# EAGLE schematic 6502-shield (EAGLE 9.6.0)

## Sheet 1 of 3
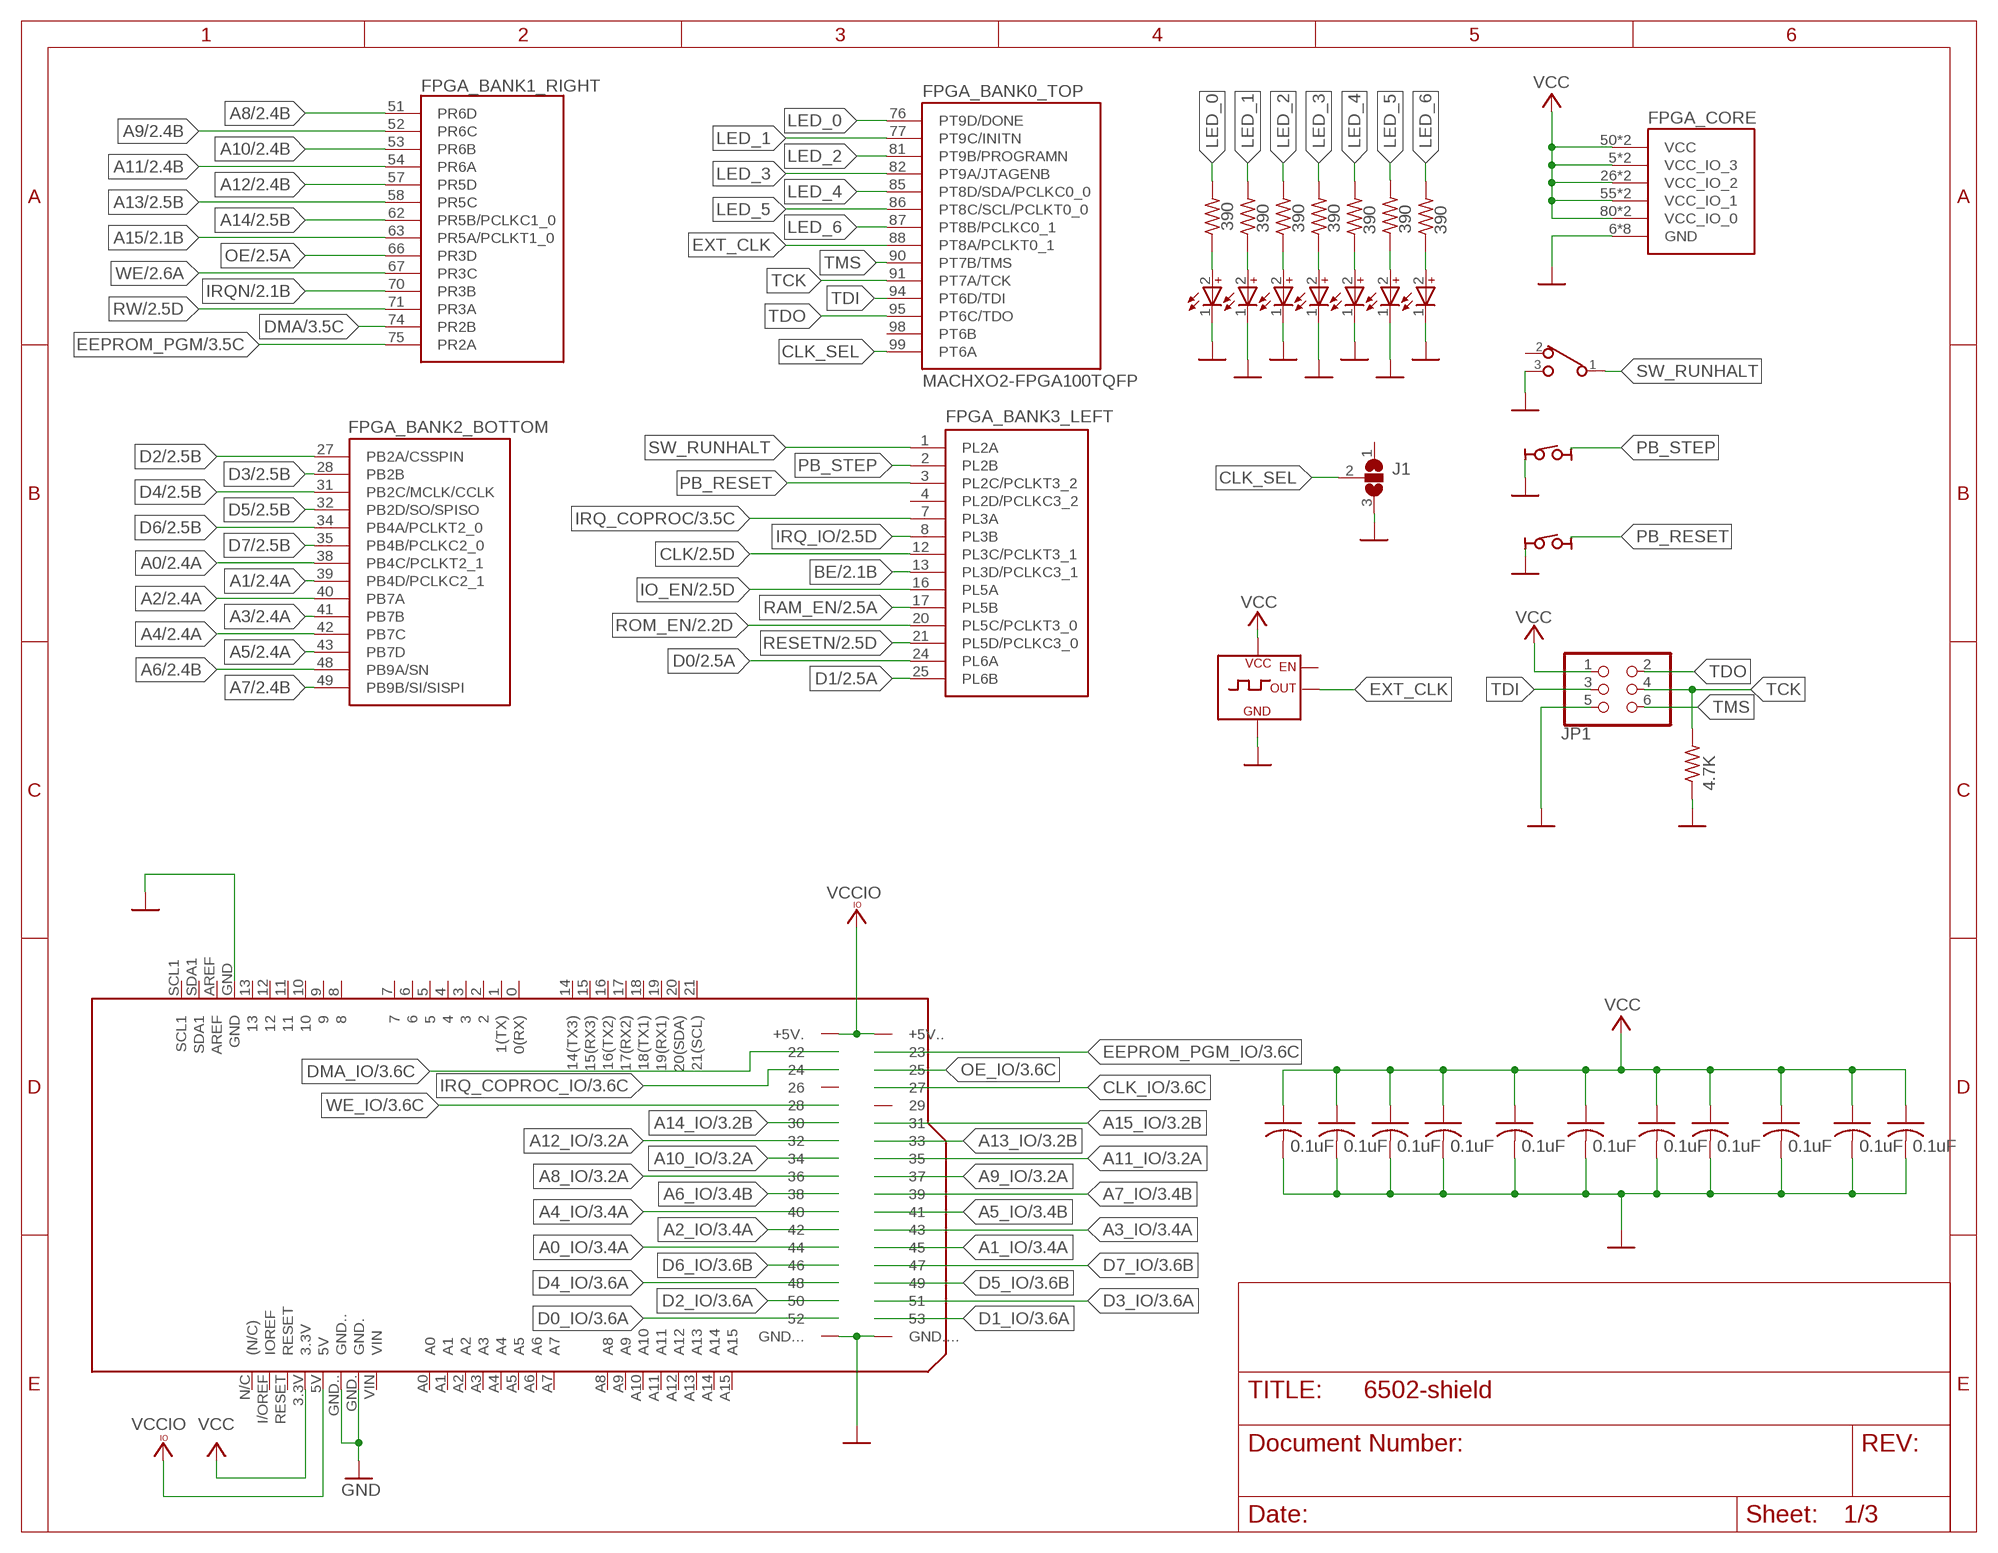
[diagram p0: schematic, sheet 1]

### Parts
C1  0.1uF  C-USC0805  [C0805]
C2  0.1uF  C-USC0805  [C0805]
C3  0.1uF  C-USC0805  [C0805]
C4  0.1uF  C-USC0805  [C0805]
C5  0.1uF  C-USC0805  [C0805]
C6  0.1uF  C-USC0805  [C0805]
C7  0.1uF  C-USC0805  [C0805]
C20  0.1uF  C-USC0805  [C0805]
C21  0.1uF  C-USC0805  [C0805]
C22  0.1uF  C-USC0805  [C0805]
C23  0.1uF  C-USC0805  [C0805]
D1  RED  WL-SMCD_0603_150060SS55040  [WL-SMCD_0603]
D2  RED  WL-SMCD_0603_150060SS55040  [WL-SMCD_0603]
D3  RED  WL-SMCD_0603_150060SS55040  [WL-SMCD_0603]
D4  RED  WL-SMCD_0603_150060SS55040  [WL-SMCD_0603]
D5  RED  WL-SMCD_0603_150060SS55040  [WL-SMCD_0603]
D6  RED  WL-SMCD_0603_150060SS55040  [WL-SMCD_0603]
D7  RED  WL-SMCD_0603_150060SS55040  [WL-SMCD_0603]
EXT_XO  CRYSTAL-OSC-DIP8/4  [DIP8/4]
FPGA  MACHXO2-FPGA100TQFP  [QFP50P1600X1600X160-100N]
J1  SJ2W  [SJ_2]
JP1  PINHD-2X3  [2X03]
PB_RESET  MCSLPT4644B1TR-TACT-SW  [MCSLPT4644B1TR-TACT-SW-NEW]
PB_STEP  MCSLPT4644B1TR-TACT-SW  [MCSLPT4644B1TR-TACT-SW-NEW]
PCB1  ARDUINO_MEGA2560  [ARDUINO_MEGA2560]
R2  390  R-US_R0603  [R0603]
R3  4.7K  R-US_R0603  [R0603]
R4  390  R-US_R0603  [R0603]
R5  390  R-US_R0603  [R0603]
R6  390  R-US_R0603  [R0603]
R7  390  R-US_R0603  [R0603]
R8  390  R-US_R0603  [R0603]
R9  390  R-US_R0603  [R0603]
SW_RUNHALT  PCM12SMTR-SPDT-RIGHT-ANG  [PCM12SMTR]

### Nets
A0: FPGA.38(_BANK2_BOTTOM:PB4C/PCLKT2_1) ; also sheet 2,3
A0_IO: PCB1.44 ; also sheet 3
A1: FPGA.39(_BANK2_BOTTOM:PB4D/PCLKC2_1) ; also sheet 2,3
A1_IO: PCB1.45 ; also sheet 3
A2: FPGA.40(_BANK2_BOTTOM:PB7A) ; also sheet 2,3
A2_IO: PCB1.42 ; also sheet 3
A3: FPGA.41(_BANK2_BOTTOM:PB7B) ; also sheet 2,3
A3_IO: PCB1.43 ; also sheet 3
A4: FPGA.42(_BANK2_BOTTOM:PB7C) ; also sheet 2,3
A4_IO: PCB1.40 ; also sheet 3
A5: FPGA.43(_BANK2_BOTTOM:PB7D) ; also sheet 2,3
A5_IO: PCB1.41 ; also sheet 3
A6: FPGA.48(_BANK2_BOTTOM:PB9A/SN) ; also sheet 2,3
A6_IO: PCB1.38 ; also sheet 3
A7: FPGA.49(_BANK2_BOTTOM:PB9B/SI/SISPI) ; also sheet 2,3
A7_IO: PCB1.39 ; also sheet 3
A8: FPGA.51(_BANK1_RIGHT:PR6D) ; also sheet 2,3
A8_IO: PCB1.36 ; also sheet 3
A9: FPGA.52(_BANK1_RIGHT:PR6C) ; also sheet 2,3
A9_IO: PCB1.37 ; also sheet 3
A10: FPGA.53(_BANK1_RIGHT:PR6B) ; also sheet 2,3
A10_IO: PCB1.34 ; also sheet 3
A11: FPGA.54(_BANK1_RIGHT:PR6A) ; also sheet 2,3
A11_IO: PCB1.35 ; also sheet 3
A12: FPGA.57(_BANK1_RIGHT:PR5D) ; also sheet 2,3
A12_IO: PCB1.32 ; also sheet 3
A13: FPGA.58(_BANK1_RIGHT:PR5C) ; also sheet 2,3
A13_IO: PCB1.33 ; also sheet 3
A14: FPGA.62(_BANK1_RIGHT:PR5B/PCLKC1_0) ; also sheet 2,3
A14_IO: PCB1.30 ; also sheet 3
A15: FPGA.63(_BANK1_RIGHT:PR5A/PCLKT1_0) ; also sheet 2,3
A15_IO: PCB1.31 ; also sheet 3
BE: FPGA.13(_BANK3_LEFT:PL3D/PCLKC3_1) ; also sheet 2
CLK: FPGA.12(_BANK3_LEFT:PL3C/PCLKT3_1) ; also sheet 2,3
CLK_IO: PCB1.27 ; also sheet 3
CLK_SEL: FPGA.99(_BANK0_TOP:PT6A) J1.2
D0: FPGA.24(_BANK3_LEFT:PL6A) ; also sheet 2,3
D0_IO: PCB1.52 ; also sheet 3
D1: FPGA.25(_BANK3_LEFT:PL6B) ; also sheet 2,3
D1_IO: PCB1.53 ; also sheet 3
D2: FPGA.27(_BANK2_BOTTOM:PB2A/CSSPIN) ; also sheet 2,3
D2_IO: PCB1.50 ; also sheet 3
D3: FPGA.28(_BANK2_BOTTOM:PB2B) ; also sheet 2,3
D3_IO: PCB1.51 ; also sheet 3
D4: FPGA.31(_BANK2_BOTTOM:PB2C/MCLK/CCLK) ; also sheet 2,3
D4_IO: PCB1.48 ; also sheet 3
D5: FPGA.32(_BANK2_BOTTOM:PB2D/SO/SPISO) ; also sheet 2,3
D5_IO: PCB1.49 ; also sheet 3
D6: FPGA.34(_BANK2_BOTTOM:PB4A/PCLKT2_0) ; also sheet 2,3
D6_IO: PCB1.46 ; also sheet 3
D7: FPGA.35(_BANK2_BOTTOM:PB4B/PCLKC2_0) ; also sheet 2,3
D7_IO: PCB1.47 ; also sheet 3
DMA: FPGA.74(_BANK1_RIGHT:PR2B) ; also sheet 3
DMA_IO: PCB1.22 ; also sheet 3
EEPROM_PGM: FPGA.75(_BANK1_RIGHT:PR2A) ; also sheet 3
EEPROM_PGM_IO: PCB1.23 ; also sheet 3
EXT_CLK: EXT_XO.5(OUT) FPGA.88(_BANK0_TOP:PT8A/PCLKT0_1)
GND: C1.2 C2.2 C3.2 C4.2 C5.2 C6.2 C7.2 C20.2 C21.2 C22.2 C23.2 D1.1(C) D2.1(C) D3.1(C) D4.1(C) D5.1(C) D6.1(C) D7.1(C) EXT_XO.4(GND) FPGA.6(_CORE:GND) FPGA.22(_CORE:GND) FPGA.33(_CORE:GND) FPGA.44(_CORE:GND) FPGA.56(_CORE:GND) FPGA.72(_CORE:GND) FPGA.79(_CORE:GND) FPGA.92(_CORE:GND) J1.3 JP1.5 PB_RESET.T2 PB_STEP.T2 PCB1.GND PCB1.GND. PCB1.GND.. PCB1.GND... PCB1.GND.... R3.1 SW_RUNHALT.3 ; also sheet 2,3
IO_EN: FPGA.16(_BANK3_LEFT:PL5A) ; also sheet 2
IRQ_COPROC: FPGA.7(_BANK3_LEFT:PL3A) ; also sheet 3
IRQ_COPROC_IO: PCB1.24 ; also sheet 3
IRQ_IO: FPGA.8(_BANK3_LEFT:PL3B) ; also sheet 2
IRQN: FPGA.70(_BANK1_RIGHT:PR3B) ; also sheet 2
LED_0: FPGA.76(_BANK0_TOP:PT9D/DONE) R5.2
LED_1: FPGA.77(_BANK0_TOP:PT9C/INITN) R6.2
LED_2: FPGA.81(_BANK0_TOP:PT9B/PROGRAMN) R7.2
LED_3: FPGA.82(_BANK0_TOP:PT9A/JTAGENB) R8.2
LED_4: FPGA.85(_BANK0_TOP:PT8D/SDA/PCLKC0_0) R9.2
LED_5: FPGA.86(_BANK0_TOP:PT8C/SCL/PCLKT0_0) R4.2
LED_6: FPGA.87(_BANK0_TOP:PT8B/PCLKC0_1) R2.2
N$9: D1.2(A) R5.1
N$10: D2.2(A) R6.1
N$11: D5.2(A) R7.1
N$12: D4.2(A) R8.1
N$13: D3.2(A) R9.1
N$14: D6.2(A) R4.1
N$15: D7.2(A) R2.1
OE: FPGA.66(_BANK1_RIGHT:PR3D) ; also sheet 2,3
OE_IO: PCB1.25 ; also sheet 3
PB_RESET: FPGA.3(_BANK3_LEFT:PL2C/PCLKT3_2) PB_RESET.T3
PB_STEP: FPGA.2(_BANK3_LEFT:PL2B) PB_STEP.T3
RAM_EN: FPGA.17(_BANK3_LEFT:PL5B) ; also sheet 2
RESETN: FPGA.21(_BANK3_LEFT:PL5D/PCLKC3_0) ; also sheet 2
ROM_EN: FPGA.20(_BANK3_LEFT:PL5C/PCLKT3_0) ; also sheet 2
RW: FPGA.71(_BANK1_RIGHT:PR3A) ; also sheet 2
SW_RUNHALT: FPGA.1(_BANK3_LEFT:PL2A) SW_RUNHALT.1
TCK: FPGA.91(_BANK0_TOP:PT7A/TCK) JP1.4 R3.2
TDI: FPGA.94(_BANK0_TOP:PT6D/TDI) JP1.3
TDO: FPGA.95(_BANK0_TOP:PT6C/TDO) JP1.2
TMS: FPGA.90(_BANK0_TOP:PT7B/TMS) JP1.6
VCC [power]: C1.1 C2.1 C3.1 C4.1 C5.1 C6.1 C7.1 C20.1 C21.1 C22.1 C23.1 EXT_XO.8(VCC) FPGA.5(_CORE:VCC_IO_3) FPGA.23(_CORE:VCC_IO_3) FPGA.26(_CORE:VCC_IO_2) FPGA.46(_CORE:VCC_IO_2) FPGA.50(_CORE:VCC) FPGA.55(_CORE:VCC_IO_1) FPGA.73(_CORE:VCC_IO_1) FPGA.80(_CORE:VCC_IO_0) FPGA.93(_CORE:VCC_IO_0) FPGA.100(_CORE:VCC) JP1.1 PCB1.3.3V ; also sheet 2,3
VCCIO [power]: PCB1.5V PCB1.5V.(+5V.) PCB1.5V..(+5V..) ; also sheet 2,3
WE: FPGA.67(_BANK1_RIGHT:PR3C) ; also sheet 2,3
WE_IO: PCB1.28 ; also sheet 3
Unconnected: EXT_XO.1(EN) FPGA.4(_BANK3_LEFT:PL2D/PCLKC3_2) FPGA.98(_BANK0_TOP:PT6B) J1.1 PB_RESET.T1 PB_RESET.T4 PB_STEP.T1 PB_STEP.T4 PCB1.0(0(RX)) PCB1.1(1(TX)) PCB1.2 PCB1.3 PCB1.4 PCB1.5 PCB1.6 PCB1.7 PCB1.8 PCB1.9 PCB1.10 PCB1.11 PCB1.12 PCB1.13 PCB1.14(14(TX3)) PCB1.15(15(RX3)) PCB1.16(16(TX2)) PCB1.17(17(RX2)) PCB1.18(18(TX1)) PCB1.19(19(RX1)) PCB1.20(20(SDA)) PCB1.21(21(SCL)) PCB1.26 PCB1.29 PCB1.A0 PCB1.A1 PCB1.A2 PCB1.A3 PCB1.A4 PCB1.A5 PCB1.A6 PCB1.A7 PCB1.A8 PCB1.A9 PCB1.A10 PCB1.A11 PCB1.A12 PCB1.A13 PCB1.A14 PCB1.A15 PCB1.AREF PCB1.I/OREF(IOREF) PCB1.N/C((N/C)) PCB1.RESET PCB1.SCL1 PCB1.SDA1 PCB1.VIN SW_RUNHALT.2

## Sheet 2 of 3
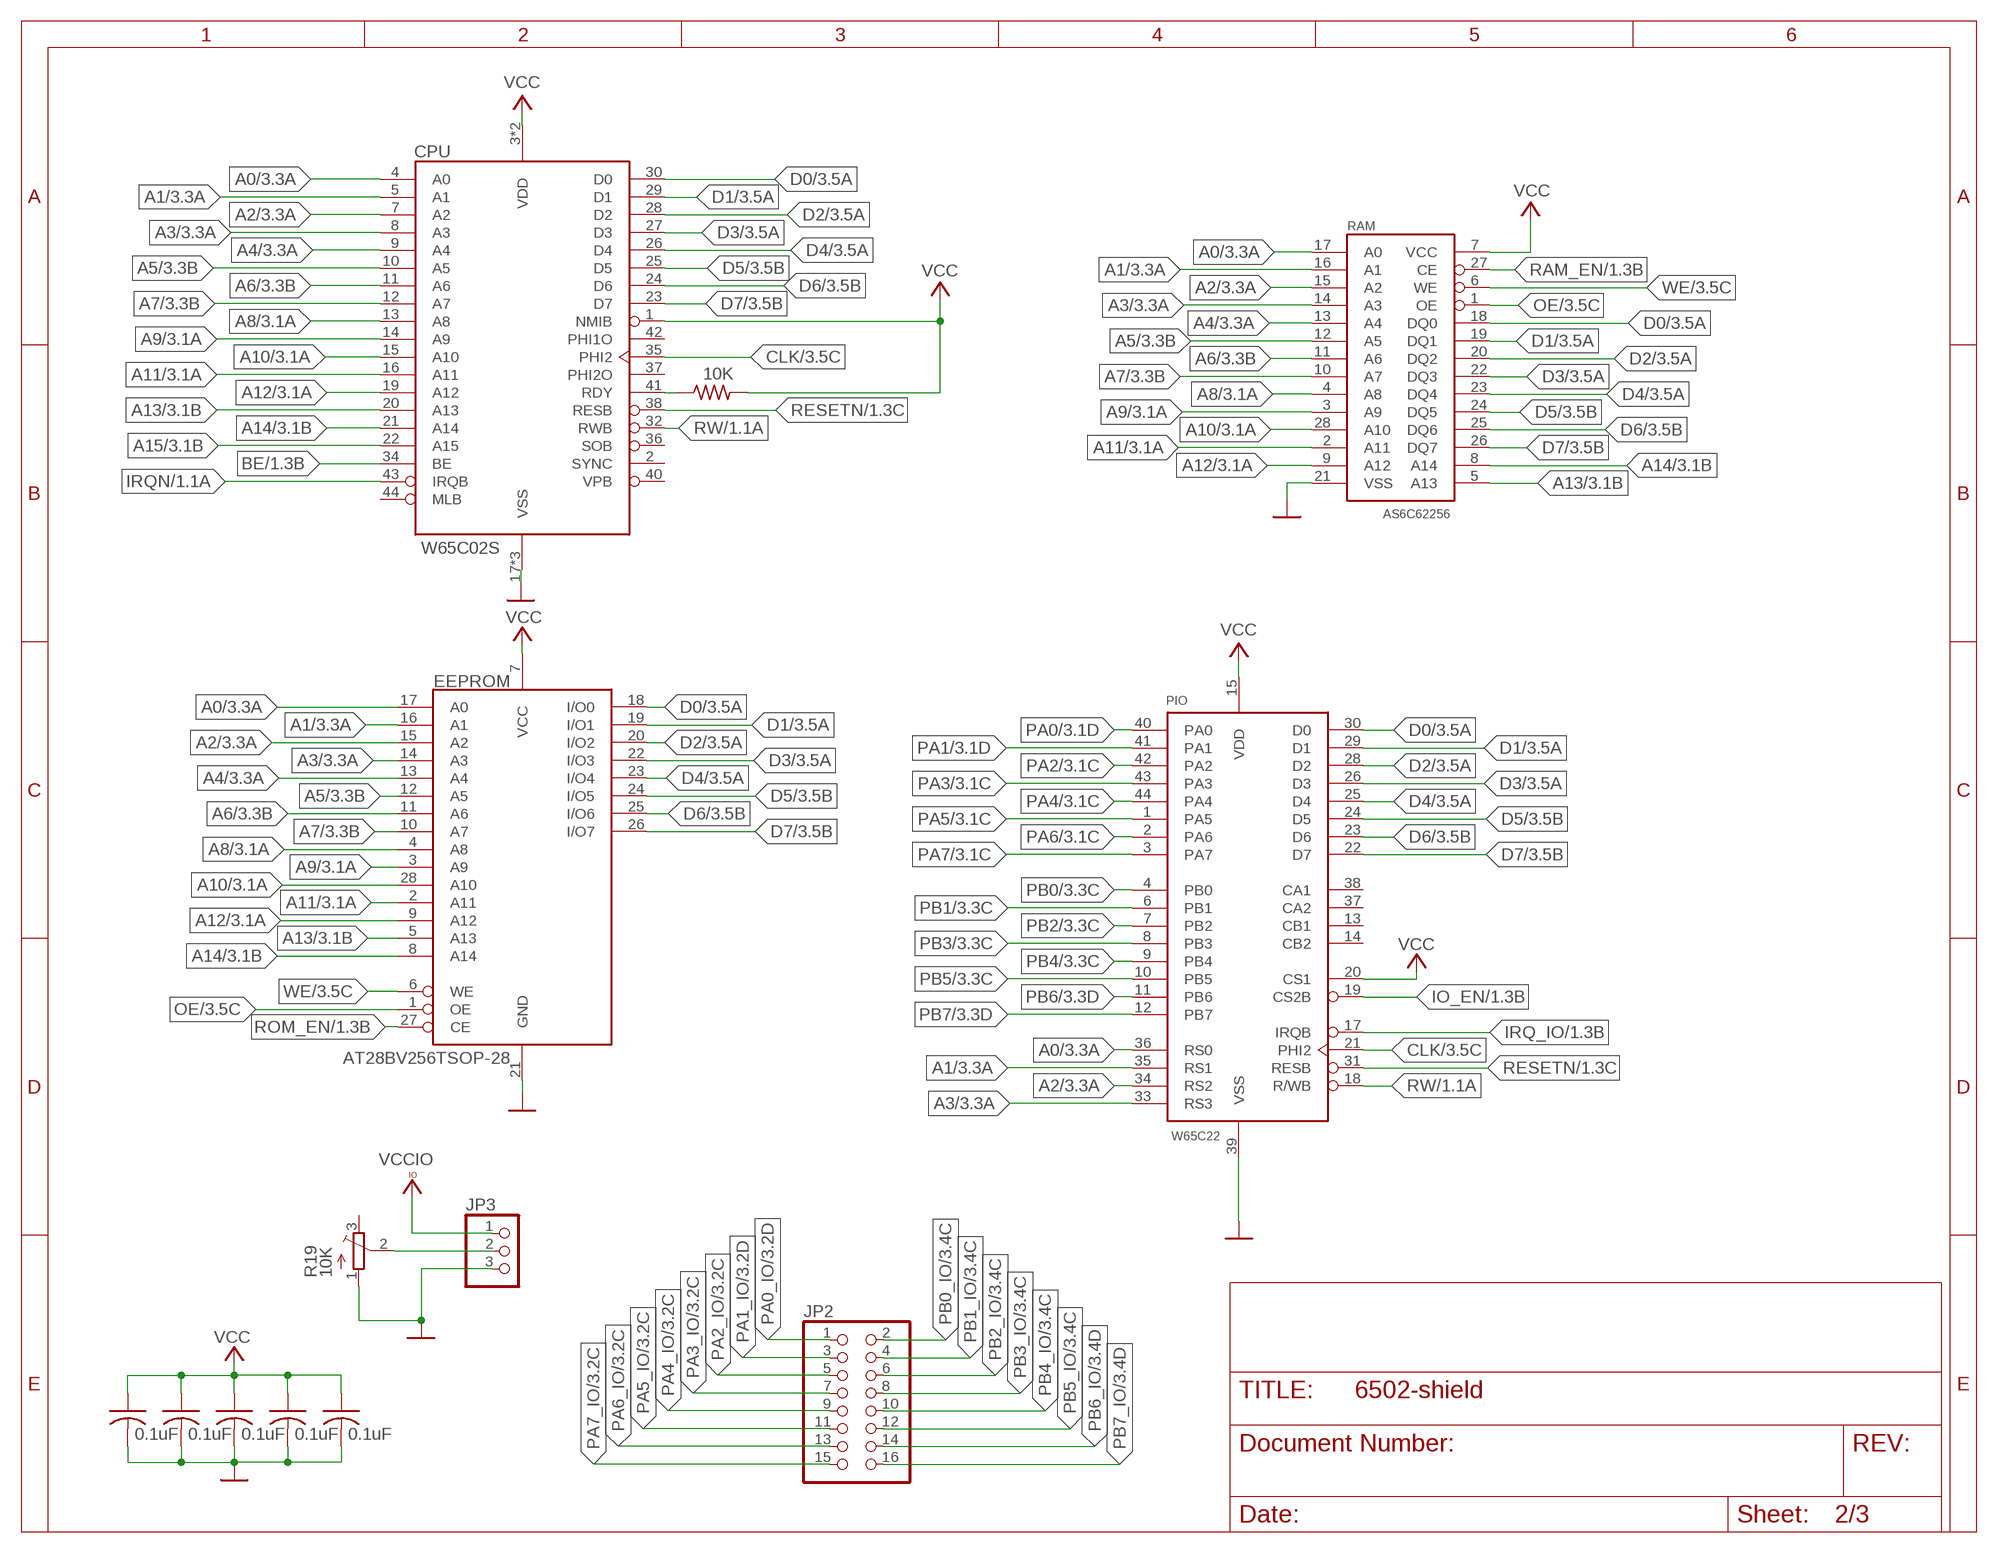
[diagram p1: schematic, sheet 2]

### Parts
C24  0.1uF  C-USC0805  [C0805]
C25  0.1uF  C-USC0805  [C0805]
C26  0.1uF  C-USC0805  [C0805]
C27  0.1uF  C-USC0805  [C0805]
C28  0.1uF  C-USC0805  [C0805]
CPU  W65C02S  [QFP80P1320X1320X270-44N]
EEPROM  AT28BV256TSOP-28  [SOP55P1340X120-28N]
JP2  PINHD-2X8  [2X08]
JP3  PINHD-1X3  [1X03]
PIO  W65C22  [QFP80P1320X1320X270-44N]
R18  10K  R-US_R0603  [R0603]
R19  10K  TRIMPOTTC33X  [TC33X]
RAM  AS6C62256  [SOP55P1340X120-28N]

### Nets
A0: CPU.4(A0) EEPROM.17(A0) PIO.36(RS0) RAM.17(A0) ; also sheet 1,3
A1: CPU.5(A1) EEPROM.16(A1) PIO.35(RS1) RAM.16(A1) ; also sheet 1,3
A2: CPU.7(A2) EEPROM.15(A2) PIO.34(RS2) RAM.15(A2) ; also sheet 1,3
A3: CPU.8(A3) EEPROM.14(A3) PIO.33(RS3) RAM.14(A3) ; also sheet 1,3
A4: CPU.9(A4) EEPROM.13(A4) RAM.13(A4) ; also sheet 1,3
A5: CPU.10(A5) EEPROM.12(A5) RAM.12(A5) ; also sheet 1,3
A6: CPU.11(A6) EEPROM.11(A6) RAM.11(A6) ; also sheet 1,3
A7: CPU.12(A7) EEPROM.10(A7) RAM.10(A7) ; also sheet 1,3
A8: CPU.13(A8) EEPROM.4(A8) RAM.4(A8) ; also sheet 1,3
A9: CPU.14(A9) EEPROM.3(A9) RAM.3(A9) ; also sheet 1,3
A10: CPU.15(A10) EEPROM.28(A10) RAM.28(A10) ; also sheet 1,3
A11: CPU.16(A11) EEPROM.2(A11) RAM.2(A11) ; also sheet 1,3
A12: CPU.19(A12) EEPROM.9(A12) RAM.9(A12) ; also sheet 1,3
A13: CPU.20(A13) EEPROM.5(A13) RAM.5(A13) ; also sheet 1,3
A14: CPU.21(A14) EEPROM.8(A14) RAM.8(A14) ; also sheet 1,3
A15: CPU.22(A15) ; also sheet 1,3
BE: CPU.34(BE) ; also sheet 1
CLK: CPU.35(PHI2) PIO.21(PHI2) ; also sheet 1,3
D0: CPU.30(D0) EEPROM.18(I/O0) PIO.30(D0) RAM.18(DQ0) ; also sheet 1,3
D1: CPU.29(D1) EEPROM.19(I/O1) PIO.29(D1) RAM.19(DQ1) ; also sheet 1,3
D2: CPU.28(D2) EEPROM.20(I/O2) PIO.28(D2) RAM.20(DQ2) ; also sheet 1,3
D3: CPU.27(D3) EEPROM.22(I/O3) PIO.26(D3) RAM.22(DQ3) ; also sheet 1,3
D4: CPU.26(D4) EEPROM.23(I/O4) PIO.25(D4) RAM.23(DQ4) ; also sheet 1,3
D5: CPU.25(D5) EEPROM.24(I/O5) PIO.24(D5) RAM.24(DQ5) ; also sheet 1,3
D6: CPU.24(D6) EEPROM.25(I/O6) PIO.23(D6) RAM.25(DQ6) ; also sheet 1,3
D7: CPU.23(D7) EEPROM.26(I/O7) PIO.22(D7) RAM.26(DQ7) ; also sheet 1,3
GND: C24.2 C25.2 C26.2 C27.2 C28.2 EEPROM.21(GND) JP3.3 PIO.39(VSS) R19.1(A) RAM.21(VSS) ; also sheet 1,3
IO_EN: PIO.19(CS2B) ; also sheet 1
IRQ_IO: PIO.17(IRQB) ; also sheet 1
IRQN: CPU.43(IRQB) ; also sheet 1
N$31: CPU.41(RDY) R18.1
N$32: JP3.2 R19.2(S)
OE: EEPROM.1(OE) RAM.1(OE) ; also sheet 1,3
PA0: PIO.40(PA0) ; also sheet 3
PA0_IO: JP2.1 ; also sheet 3
PA1: PIO.41(PA1) ; also sheet 3
PA1_IO: JP2.3 ; also sheet 3
PA2: PIO.42(PA2) ; also sheet 3
PA2_IO: JP2.5 ; also sheet 3
PA3: PIO.43(PA3) ; also sheet 3
PA3_IO: JP2.7 ; also sheet 3
PA4: PIO.44(PA4) ; also sheet 3
PA4_IO: JP2.9 ; also sheet 3
PA5: PIO.1(PA5) ; also sheet 3
PA5_IO: JP2.11 ; also sheet 3
PA6: PIO.2(PA6) ; also sheet 3
PA6_IO: JP2.13 ; also sheet 3
PA7: PIO.3(PA7) ; also sheet 3
PA7_IO: JP2.15 ; also sheet 3
PB0: PIO.4(PB0) ; also sheet 3
PB0_IO: JP2.2 ; also sheet 3
PB1: PIO.6(PB1) ; also sheet 3
PB1_IO: JP2.4 ; also sheet 3
PB2: PIO.7(PB2) ; also sheet 3
PB2_IO: JP2.6 ; also sheet 3
PB3: PIO.8(PB3) ; also sheet 3
PB3_IO: JP2.8 ; also sheet 3
PB4: PIO.9(PB4) ; also sheet 3
PB4_IO: JP2.10 ; also sheet 3
PB5: PIO.10(PB5) ; also sheet 3
PB5_IO: JP2.12 ; also sheet 3
PB6: PIO.11(PB6) ; also sheet 3
PB6_IO: JP2.14 ; also sheet 3
PB7: PIO.12(PB7) ; also sheet 3
PB7_IO: JP2.16 ; also sheet 3
RAM_EN: RAM.27(CE) ; also sheet 1
RESETN: CPU.38(RESB) PIO.31(RESB) ; also sheet 1
ROM_EN: EEPROM.27(CE) ; also sheet 1
RW: CPU.32(RWB) PIO.18(R/WB) ; also sheet 1
VCC [power]: C24.1 C25.1 C26.1 C27.1 C28.1 CPU.1(NMIB) CPU.3(VDD) CPU.31(VDD) EEPROM.7(VCC) PIO.15(VDD) PIO.20(CS1) R18.2 RAM.7(VCC) ; also sheet 1,3
VCCIO [power]: JP3.1 ; also sheet 1,3
WE: EEPROM.6(WE) RAM.6(WE) ; also sheet 1,3
Unconnected: CPU.2(SYNC) CPU.17(VSS) CPU.18(VSS) CPU.36(SOB) CPU.37(PHI2O) CPU.39(VSS) CPU.40(VPB) CPU.42(PHI1O) CPU.44(MLB) PIO.13(CB1) PIO.14(CB2) PIO.37(CA2) PIO.38(CA1) R19.3(E)

## Sheet 3 of 3
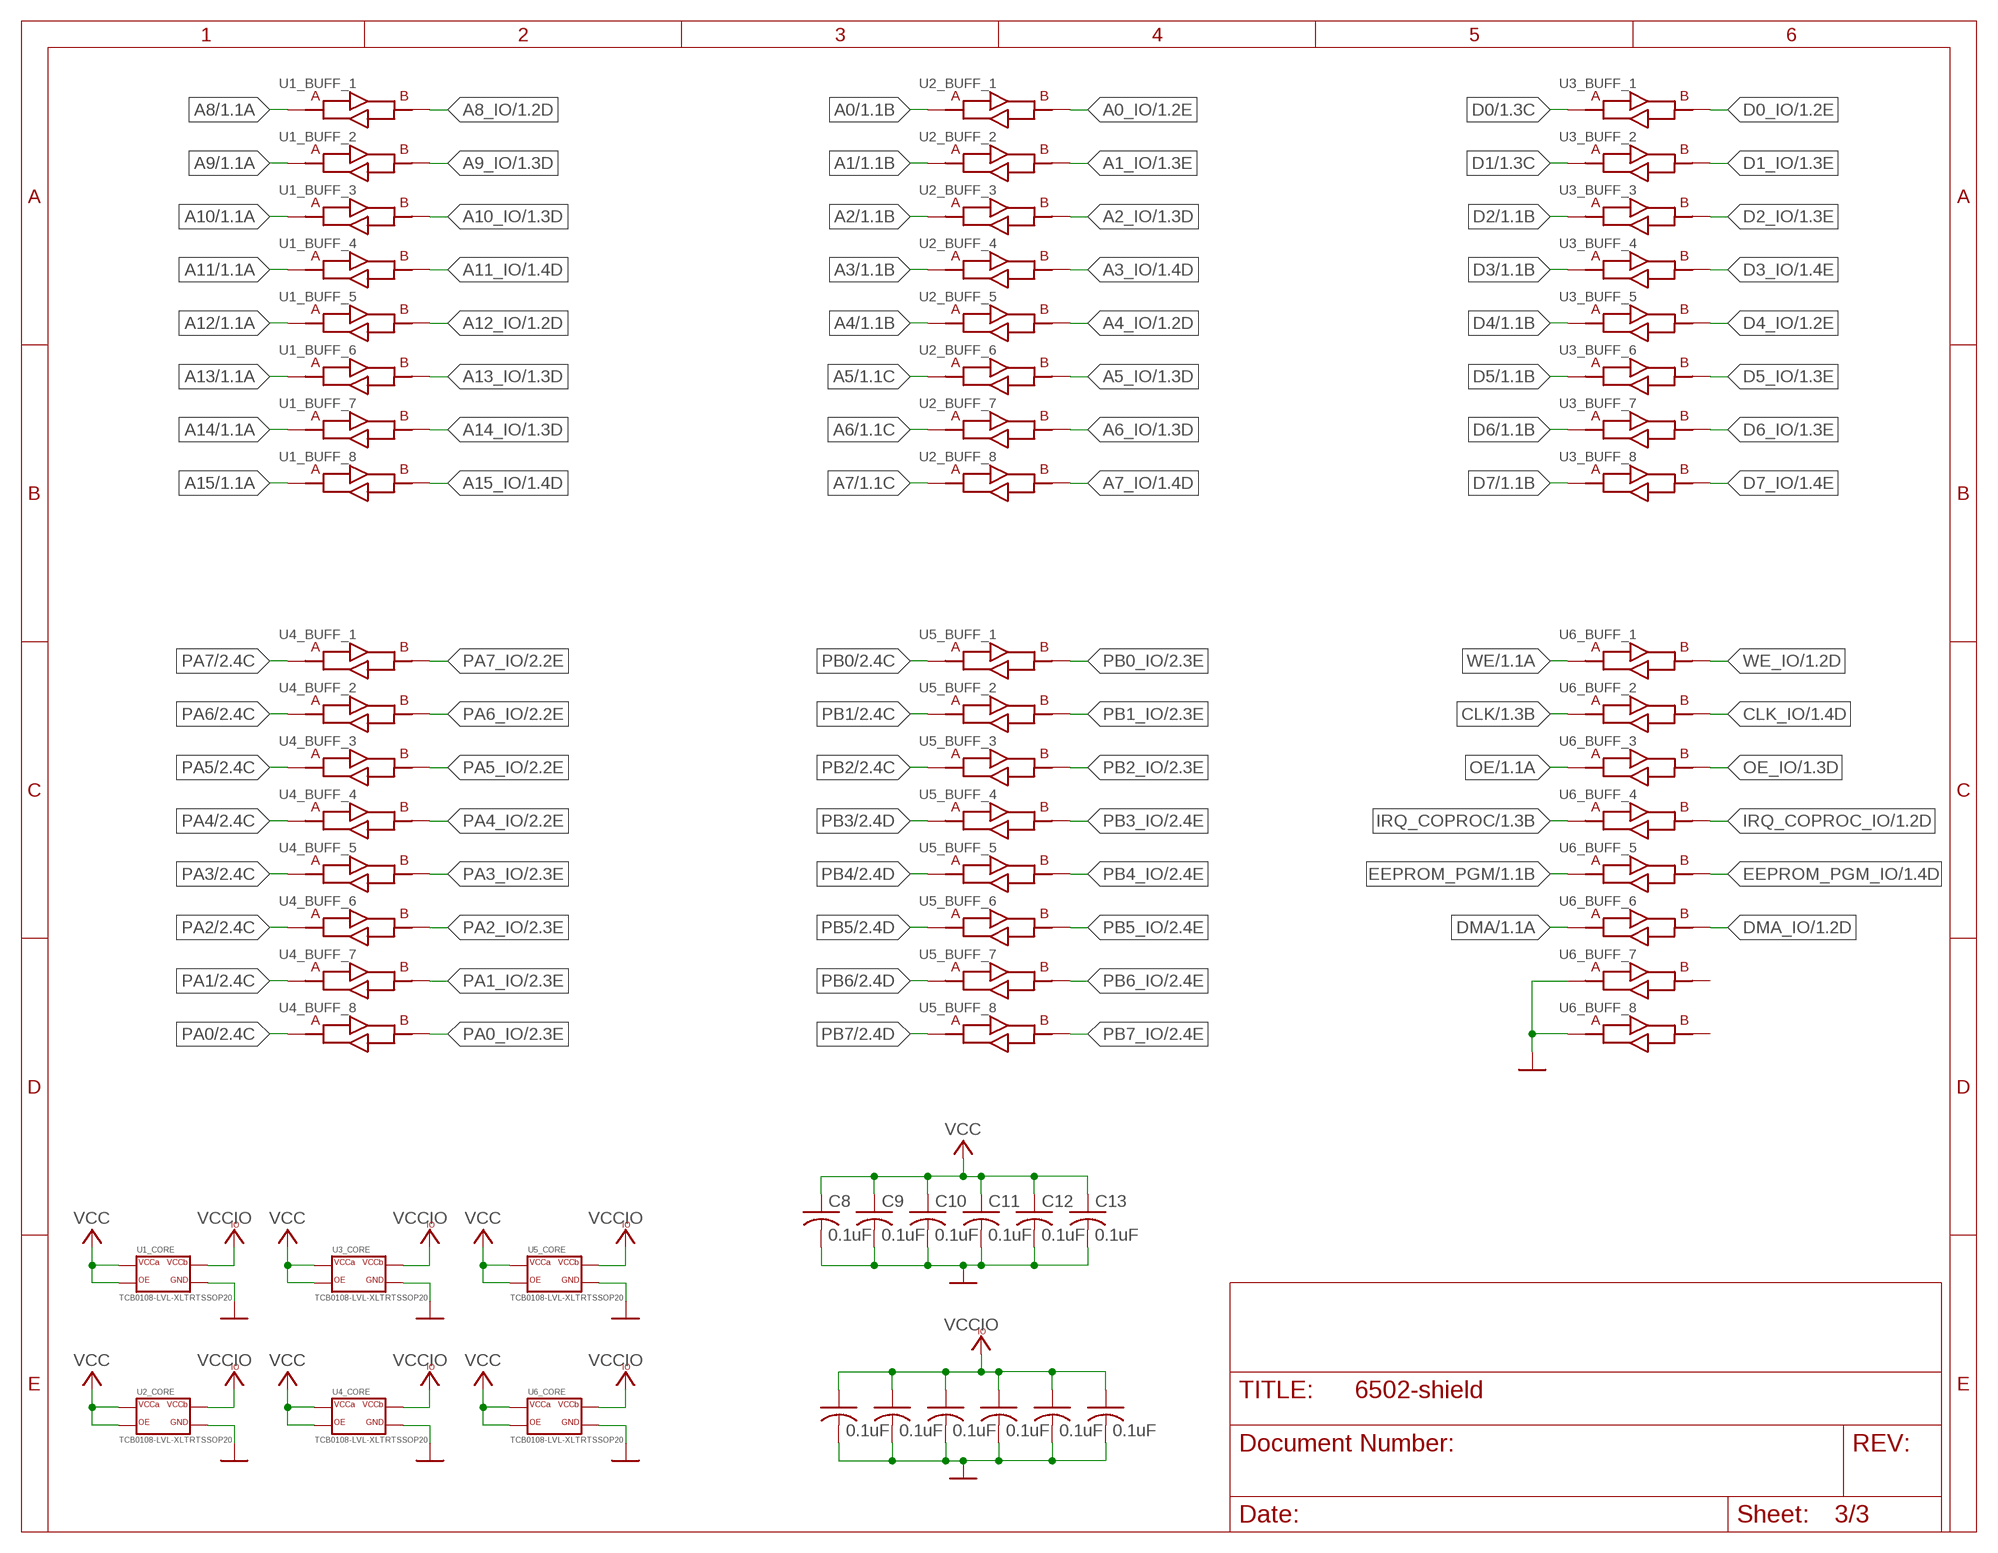
[diagram p2: schematic, sheet 3]

### Parts
C8  0.1uF  C-USC0805  [C0805]
C9  0.1uF  C-USC0805  [C0805]
C10  0.1uF  C-USC0805  [C0805]
C11  0.1uF  C-USC0805  [C0805]
C12  0.1uF  C-USC0805  [C0805]
C13  0.1uF  C-USC0805  [C0805]
C14  0.1uF  C-USC0805  [C0805]
C15  0.1uF  C-USC0805  [C0805]
C16  0.1uF  C-USC0805  [C0805]
C17  0.1uF  C-USC0805  [C0805]
C18  0.1uF  C-USC0805  [C0805]
C19  0.1uF  C-USC0805  [C0805]
U1  TCB0108-LVL-XLTRTSSOP20  [SOP65P640X120-20N]
U2  TCB0108-LVL-XLTRTSSOP20  [SOP65P640X120-20N]
U3  TCB0108-LVL-XLTRTSSOP20  [SOP65P640X120-20N]
U4  TCB0108-LVL-XLTRTSSOP20  [SOP65P640X120-20N]
U5  TCB0108-LVL-XLTRTSSOP20  [SOP65P640X120-20N]
U6  TCB0108-LVL-XLTRTSSOP20  [SOP65P640X120-20N]

### Nets
A0: U2.1(_BUFF_1:A) ; also sheet 1,2
A0_IO: U2.20(_BUFF_1:B) ; also sheet 1
A1: U2.3(_BUFF_2:A) ; also sheet 1,2
A1_IO: U2.18(_BUFF_2:B) ; also sheet 1
A2: U2.4(_BUFF_3:A) ; also sheet 1,2
A2_IO: U2.17(_BUFF_3:B) ; also sheet 1
A3: U2.5(_BUFF_4:A) ; also sheet 1,2
A3_IO: U2.16(_BUFF_4:B) ; also sheet 1
A4: U2.6(_BUFF_5:A) ; also sheet 1,2
A4_IO: U2.15(_BUFF_5:B) ; also sheet 1
A5: U2.7(_BUFF_6:A) ; also sheet 1,2
A5_IO: U2.14(_BUFF_6:B) ; also sheet 1
A6: U2.8(_BUFF_7:A) ; also sheet 1,2
A6_IO: U2.13(_BUFF_7:B) ; also sheet 1
A7: U2.9(_BUFF_8:A) ; also sheet 1,2
A7_IO: U2.12(_BUFF_8:B) ; also sheet 1
A8: U1.1(_BUFF_1:A) ; also sheet 1,2
A8_IO: U1.20(_BUFF_1:B) ; also sheet 1
A9: U1.3(_BUFF_2:A) ; also sheet 1,2
A9_IO: U1.18(_BUFF_2:B) ; also sheet 1
A10: U1.4(_BUFF_3:A) ; also sheet 1,2
A10_IO: U1.17(_BUFF_3:B) ; also sheet 1
A11: U1.5(_BUFF_4:A) ; also sheet 1,2
A11_IO: U1.16(_BUFF_4:B) ; also sheet 1
A12: U1.6(_BUFF_5:A) ; also sheet 1,2
A12_IO: U1.15(_BUFF_5:B) ; also sheet 1
A13: U1.7(_BUFF_6:A) ; also sheet 1,2
A13_IO: U1.14(_BUFF_6:B) ; also sheet 1
A14: U1.8(_BUFF_7:A) ; also sheet 1,2
A14_IO: U1.13(_BUFF_7:B) ; also sheet 1
A15: U1.9(_BUFF_8:A) ; also sheet 1,2
A15_IO: U1.12(_BUFF_8:B) ; also sheet 1
CLK: U6.3(_BUFF_2:A) ; also sheet 1,2
CLK_IO: U6.18(_BUFF_2:B) ; also sheet 1
D0: U3.1(_BUFF_1:A) ; also sheet 1,2
D0_IO: U3.20(_BUFF_1:B) ; also sheet 1
D1: U3.3(_BUFF_2:A) ; also sheet 1,2
D1_IO: U3.18(_BUFF_2:B) ; also sheet 1
D2: U3.4(_BUFF_3:A) ; also sheet 1,2
D2_IO: U3.17(_BUFF_3:B) ; also sheet 1
D3: U3.5(_BUFF_4:A) ; also sheet 1,2
D3_IO: U3.16(_BUFF_4:B) ; also sheet 1
D4: U3.6(_BUFF_5:A) ; also sheet 1,2
D4_IO: U3.15(_BUFF_5:B) ; also sheet 1
D5: U3.7(_BUFF_6:A) ; also sheet 1,2
D5_IO: U3.14(_BUFF_6:B) ; also sheet 1
D6: U3.8(_BUFF_7:A) ; also sheet 1,2
D6_IO: U3.13(_BUFF_7:B) ; also sheet 1
D7: U3.9(_BUFF_8:A) ; also sheet 1,2
D7_IO: U3.12(_BUFF_8:B) ; also sheet 1
DMA: U6.7(_BUFF_6:A) ; also sheet 1
DMA_IO: U6.14(_BUFF_6:B) ; also sheet 1
EEPROM_PGM: U6.6(_BUFF_5:A) ; also sheet 1
EEPROM_PGM_IO: U6.15(_BUFF_5:B) ; also sheet 1
GND: C8.2 C9.2 C10.2 C11.2 C12.2 C13.2 C14.2 C15.2 C16.2 C17.2 C18.2 C19.2 U1.11(_CORE:GND) U2.11(_CORE:GND) U3.11(_CORE:GND) U4.11(_CORE:GND) U5.11(_CORE:GND) U6.8(_BUFF_7:A) U6.9(_BUFF_8:A) U6.11(_CORE:GND) ; also sheet 1,2
IRQ_COPROC: U6.5(_BUFF_4:A) ; also sheet 1
IRQ_COPROC_IO: U6.16(_BUFF_4:B) ; also sheet 1
OE: U6.4(_BUFF_3:A) ; also sheet 1,2
OE_IO: U6.17(_BUFF_3:B) ; also sheet 1
PA0: U4.9(_BUFF_8:A) ; also sheet 2
PA0_IO: U4.12(_BUFF_8:B) ; also sheet 2
PA1: U4.8(_BUFF_7:A) ; also sheet 2
PA1_IO: U4.13(_BUFF_7:B) ; also sheet 2
PA2: U4.7(_BUFF_6:A) ; also sheet 2
PA2_IO: U4.14(_BUFF_6:B) ; also sheet 2
PA3: U4.6(_BUFF_5:A) ; also sheet 2
PA3_IO: U4.15(_BUFF_5:B) ; also sheet 2
PA4: U4.5(_BUFF_4:A) ; also sheet 2
PA4_IO: U4.16(_BUFF_4:B) ; also sheet 2
PA5: U4.4(_BUFF_3:A) ; also sheet 2
PA5_IO: U4.17(_BUFF_3:B) ; also sheet 2
PA6: U4.3(_BUFF_2:A) ; also sheet 2
PA6_IO: U4.18(_BUFF_2:B) ; also sheet 2
PA7: U4.1(_BUFF_1:A) ; also sheet 2
PA7_IO: U4.20(_BUFF_1:B) ; also sheet 2
PB0: U5.1(_BUFF_1:A) ; also sheet 2
PB0_IO: U5.20(_BUFF_1:B) ; also sheet 2
PB1: U5.3(_BUFF_2:A) ; also sheet 2
PB1_IO: U5.18(_BUFF_2:B) ; also sheet 2
PB2: U5.4(_BUFF_3:A) ; also sheet 2
PB2_IO: U5.17(_BUFF_3:B) ; also sheet 2
PB3: U5.5(_BUFF_4:A) ; also sheet 2
PB3_IO: U5.16(_BUFF_4:B) ; also sheet 2
PB4: U5.6(_BUFF_5:A) ; also sheet 2
PB4_IO: U5.15(_BUFF_5:B) ; also sheet 2
PB5: U5.7(_BUFF_6:A) ; also sheet 2
PB5_IO: U5.14(_BUFF_6:B) ; also sheet 2
PB6: U5.8(_BUFF_7:A) ; also sheet 2
PB6_IO: U5.13(_BUFF_7:B) ; also sheet 2
PB7: U5.9(_BUFF_8:A) ; also sheet 2
PB7_IO: U5.12(_BUFF_8:B) ; also sheet 2
VCC [power]: C8.1 C9.1 C10.1 C11.1 C12.1 C13.1 U1.2(_CORE:VCC_A) U1.10(_CORE:OE) U2.2(_CORE:VCC_A) U2.10(_CORE:OE) U3.2(_CORE:VCC_A) U3.10(_CORE:OE) U4.2(_CORE:VCC_A) U4.10(_CORE:OE) U5.2(_CORE:VCC_A) U5.10(_CORE:OE) U6.2(_CORE:VCC_A) U6.10(_CORE:OE) ; also sheet 1,2
VCCIO [power]: C14.1 C15.1 C16.1 C17.1 C18.1 C19.1 U1.19(_CORE:VCC_B) U2.19(_CORE:VCC_B) U3.19(_CORE:VCC_B) U4.19(_CORE:VCC_B) U5.19(_CORE:VCC_B) U6.19(_CORE:VCC_B) ; also sheet 1,2
WE: U6.1(_BUFF_1:A) ; also sheet 1,2
WE_IO: U6.20(_BUFF_1:B) ; also sheet 1
Unconnected: U6.12(_BUFF_8:B) U6.13(_BUFF_7:B)

## Library data of the parts
C1-C28 = rcl:C-US: CAPACITOR, American symbol; SPICEPREFIX: C
CPU = 6502-shield:W65C02S: w65c02s 8-bit microprocessor
D1-D7 = we-led:WL-SMCD_0603: WL-SMCD SMD Mono-color Chip LED Diffused Characteristics Industrial 0603 platform – 1.6 x 0.8 mm Wide viewing angle 140° Thin version: 0.4 mm Applications Office Automation Home appliances Industrial equipment Front panel backlighting Button backlighting LCD backlighting Navigation backlighting <http://katalog.we-online.de/media/images/v2/Family_WL-SMCD_0603_thin_0,4mm_150060xx55040.jpg> Details see: http://katalog.we-online.de/en/led/WL-SMCD?m Created By Yingchun Shan 2018-03-09 2018 (C) Wurth Elektronik
EEPROM = 6502-shield:AT28BV256: AT28BV256 Atmel 256K (32K x 8) Battery-voltage Parallel EEPROM (2.7 VDC - 3.6 VDC)
EXT_XO = 6502-shield:CRYSTAL-OSC-DIP8/4: Oscillator socket, half size. 8-DIP 4 lead
FPGA = 6502-shield:MACHXO2-FPGA: Lattice Semiconductors MachXO2 FPGA (256/640/1200/2280 LUTs) 1.2/1.8/2.5/3.3 VDC
J1 = jumper:SJ2W: SMD solder JUMPER
JP1 = pinhead:PINHD-2X3: PIN HEADER
JP2 = pinhead:PINHD-2X8: PIN HEADER
JP3 = pinhead:PINHD-1X3: PIN HEADER
PB_RESET PB_STEP = 6502-shield:MCSLPT4644B1TR-TACT-SW: TE MCSLPT4644B1TR Tactile switch 4.6 x 4.4 x 0.55 mm
PCB1 = E14_Arduino_revC:ARDUINO_MEGA2560: Device for representing an Arduino Mega 2560 board with a footprint in an EAGLE design. Created by Dave Young for Element14. More EAGLE documentation at: http://www.element14.com/community/community/knode/cadsoft_eagle
PIO = 6502-shield:W65C22: W65C22 I/O Controller Interface IC Interface Adapter
R2-R9 R18 = rcl:R-US_: RESISTOR, American symbol; SPICEPREFIX: R
R19 = 6502-shield:TRIMPOT: SMT trimmer potentiometer part number TC33X http://www.ladyada.net/library/eagle
RAM = 6502-shield:AS6C62256: AS6C62256 256K, 2.7V - 5.5V 55ns 32K x 8 async SRAM
SW_RUNHALT = 6502-shield:PCM12SMTR-SPDT-RIGHT-ANG: C&K PCM12SMTR SPDT Slide Switch ON-ON SMD Right Angle
U1-U6 = 6502-shield:TCB0108-LVL-XLTR: Texas Instruments TXB0108 8-Bit Bidirectional Voltage-Level Translator with Auto-Direction Sensing and +/- 15-kV ESD Protection Datasheet: http://www.ti.com/lit/ds/symlink/txb0108.pdf Mouser: https://www.mouser.com/ProductDetail/Texas-Instruments/TXB0108PWR?qs=sGAEpiMZZMupTq4AYuRvQKKOVTxKvBsp

## Net classes
1 power: width 0.254 mm